# EAGLE design cartridge_adapter (EAGLE 7.5.0)
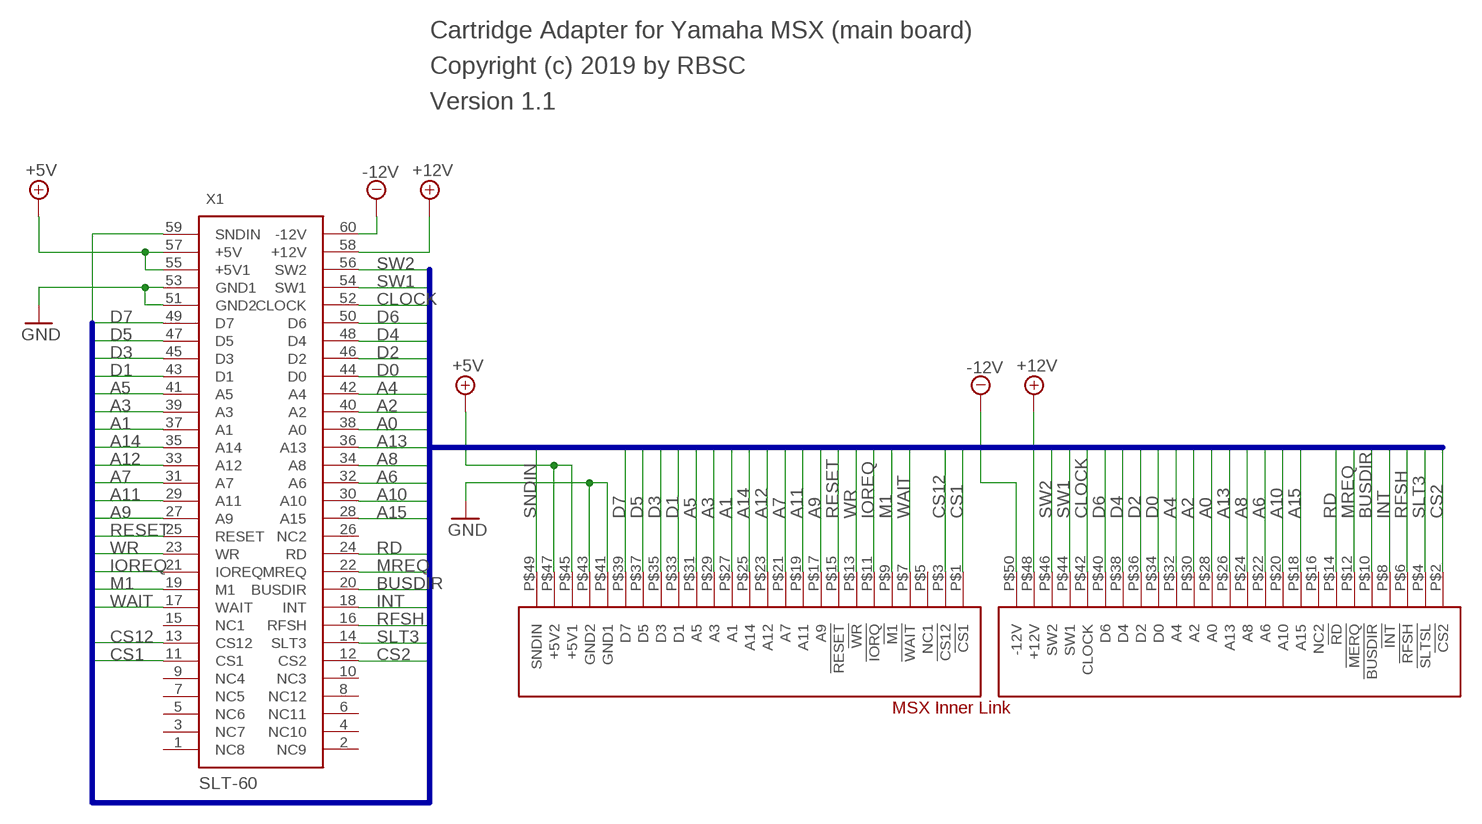
[diagram p0: schematic, sheet 1]

## Parts
CN3  MSX_INNER_LINK  [MSX_INNER_LINK]
X1  SLT-60  [SLT-60]

## Nets
+5V: CN3.P$45(+5V1) CN3.P$47(+5V2) X1.55(+5V1) X1.57(+5V)
+12V: CN3.P$48(+12V) X1.58(+12V)
-12V: CN3.P$50(-12V) X1.60(-12V)
A0: CN3.P$28(A0) X1.38(A0)
A1: CN3.P$27(A1) X1.37(A1)
A2: CN3.P$30(A2) X1.40(A2)
A3: CN3.P$29(A3) X1.39(A3)
A4: CN3.P$32(A4) X1.42(A4)
A5: CN3.P$31(A5) X1.41(A5)
A6: CN3.P$22(A6) X1.32(A6)
A7: CN3.P$21(A7) X1.31(A7)
A8: CN3.P$24(A8) X1.34(A8)
A9: CN3.P$17(A9) X1.27(A9)
A10: CN3.P$20(A10) X1.30(A10)
A11: CN3.P$19(A11) X1.29(A11)
A12: CN3.P$23(A12) X1.33(A12)
A13: CN3.P$26(A13) X1.36(A13)
A14: CN3.P$25(A14) X1.35(A14)
A15: CN3.P$18(A15) X1.28(A15)
BUSDIR: CN3.P$10(!BUSDIR) X1.20(BUSDIR)
CLOCK: CN3.P$42(CLOCK) X1.52(CLOCK)
CS1: CN3.P$1(!CS1) X1.11(CS1)
CS2: CN3.P$2(!CS2) X1.12(CS2)
CS12: CN3.P$3(!CS12) X1.13(CS12)
D0: CN3.P$34(D0) X1.44(D0)
D1: CN3.P$33(D1) X1.43(D1)
D2: CN3.P$36(D2) X1.46(D2)
D3: CN3.P$35(D3) X1.45(D3)
D4: CN3.P$38(D4) X1.48(D4)
D5: CN3.P$37(D5) X1.47(D5)
D6: CN3.P$40(D6) X1.50(D6)
D7: CN3.P$39(D7) X1.49(D7)
GND: CN3.P$41(GND1) CN3.P$43(GND2) X1.51(GND2) X1.53(GND1)
INT: CN3.P$8(!INT) X1.18(INT)
IOREQ: CN3.P$11(!IORQ) X1.21(IOREQ)
M1: CN3.P$9(!M1) X1.19(M1)
MREQ: CN3.P$12(!MERQ) X1.22(MREQ)
RD: CN3.P$14(!RD) X1.24(RD)
RESET: CN3.P$15(!RESET) X1.25(RESET)
RFSH: CN3.P$6(!RFSH) X1.16(RFSH)
SLT3: CN3.P$4(!SLTSL) X1.14(SLT3)
SNDIN: CN3.P$49(SNDIN) X1.59(SNDIN)
SW1: CN3.P$44(SW1) X1.54(SW1)
SW2: CN3.P$46(SW2) X1.56(SW2)
WAIT: CN3.P$7(!WAIT) X1.17(WAIT)
WR: CN3.P$13(!WR) X1.23(WR)
Unconnected: CN3.P$5(NC1) CN3.P$16(NC2) X1.1(NC8) X1.2(NC9) X1.3(NC7) X1.4(NC10) X1.5(NC6) X1.6(NC11) X1.7(NC5) X1.8(NC12) X1.9(NC4) X1.10(NC3) X1.15(NC1) X1.26(NC2)

## Buses
D0,D1,D2,D3,D4,D5,D6,D7,A0,A1,A2,A3,A4,A5,A6,A7,A8,A9,A10,A11,A12,A13,A14,A15,CS1,CS2,CS12,SLT3,RFSH,WAIT,INT,M1,BUSDIR,IOREQ,MREQ,WR,RD,RESET,GND,CLOCK,SW1,SW2,SNDIN

## Notes on the sheet
- Cartridge Adapter for Yamaha MSX (main board)
- Copyright (c) 2019 by RBSC
- Version 1.1

## Library data of the parts
CN3 = msx_inner_link:MSX_INNER_LINK
X1 = slt-60:SLT-60: 60-pin connector side slot

## Board
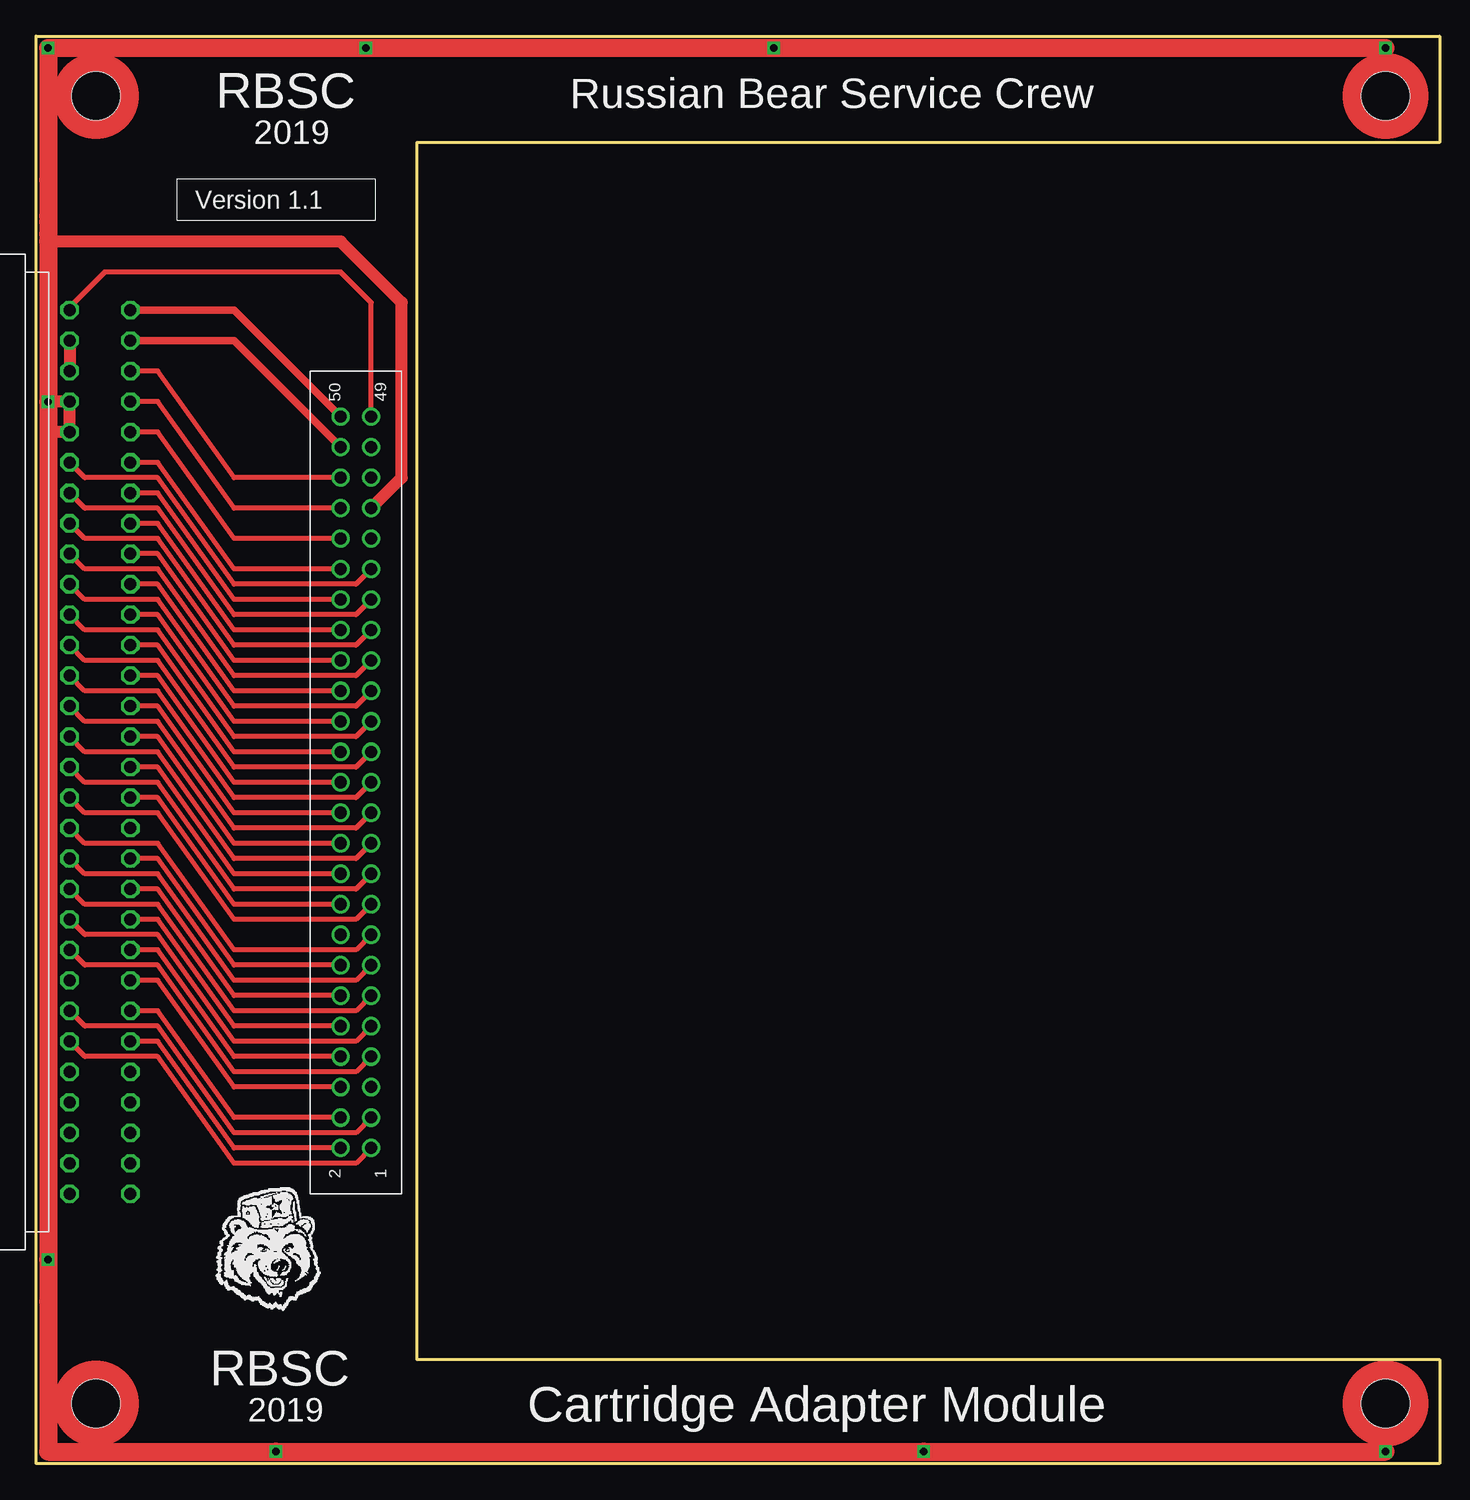
[diagram p1: board, top side]
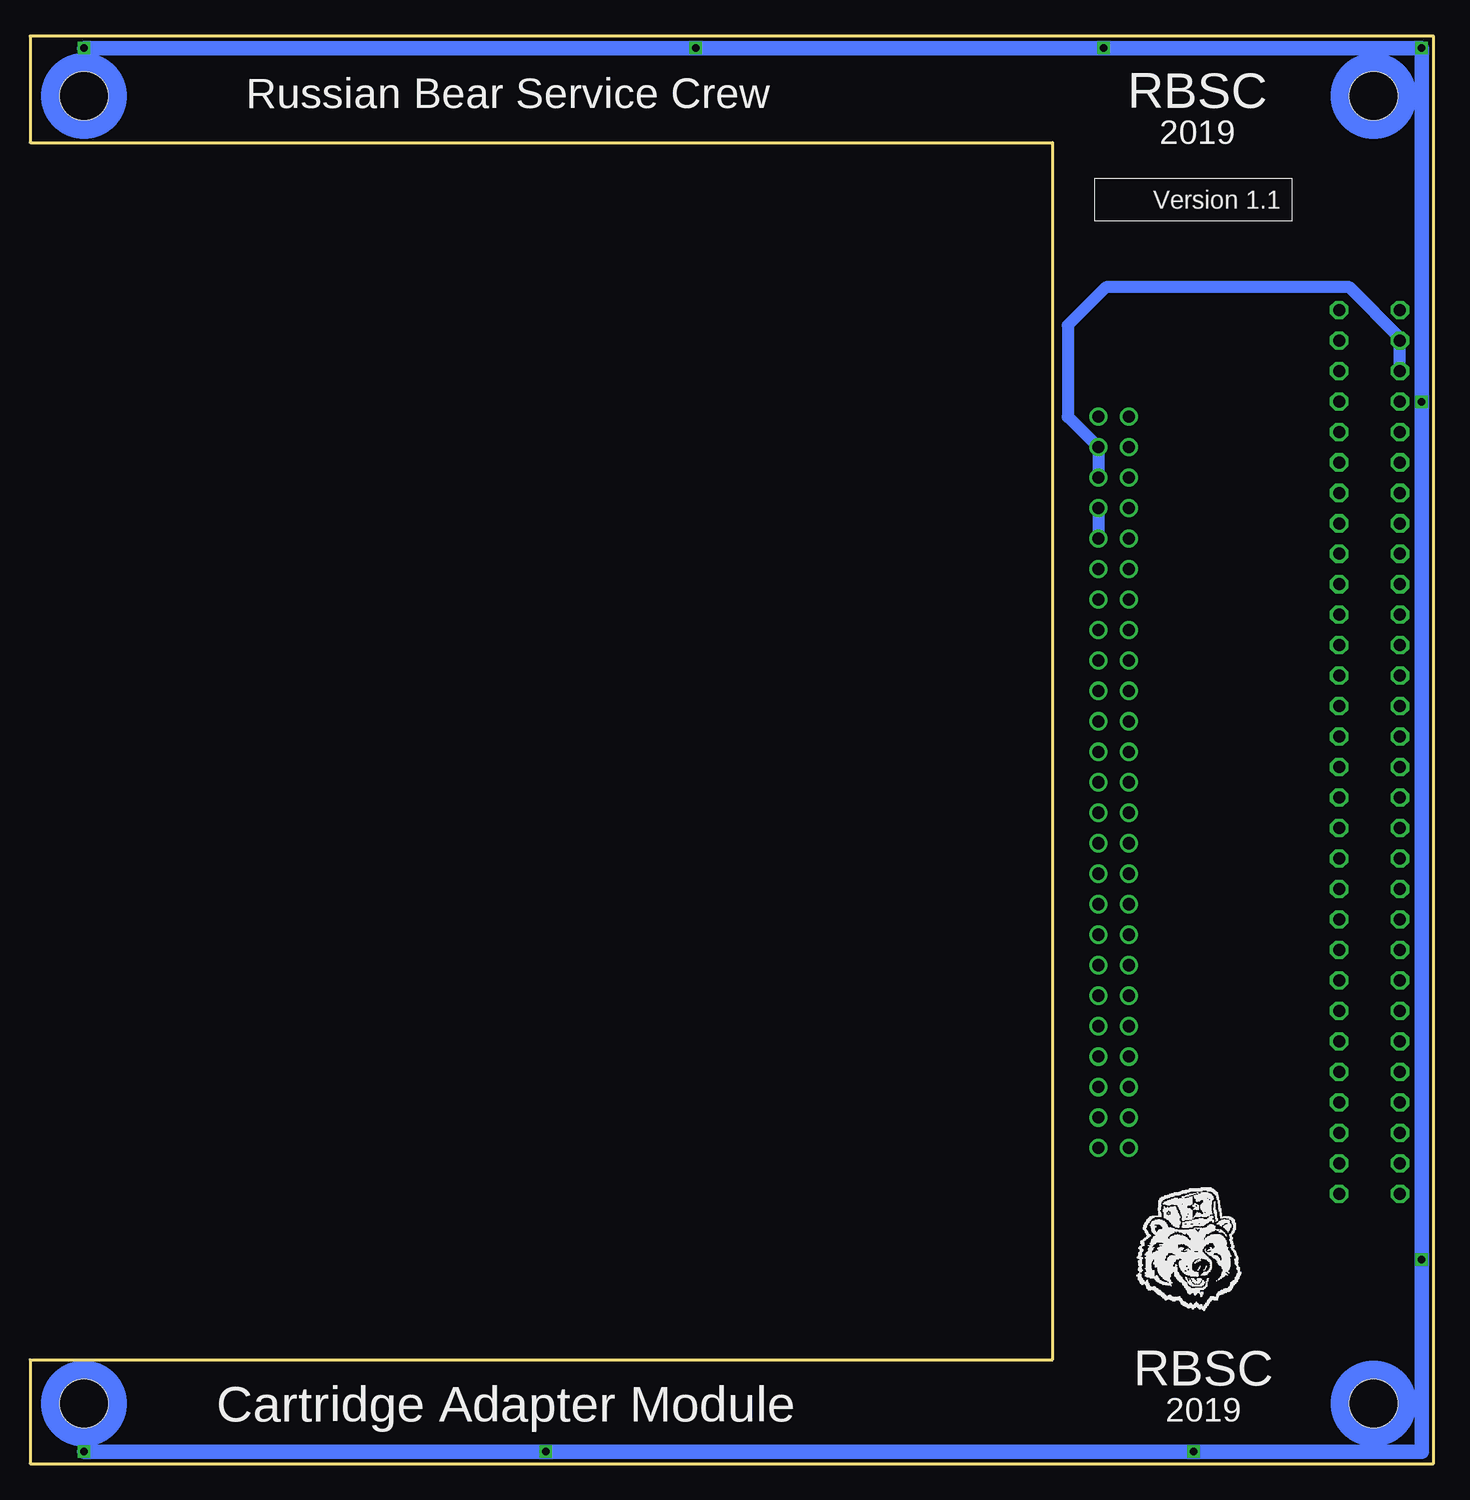
[diagram p2: board, bottom side, seen from below]

Size 117 x 119 mm. Coordinates in mm from the lower left corner, seen from the top.
Outline: 31.75,25.67 31.75,45.35
Outline: 31.75,49.16 31.75,68.22
Outline: 31.75,72.03 31.75,99.97
Outline: 0,0 0,119 117,119 117,110.12 31.75,110.12 31.75,8.65 117,8.65 117,0 0,0
Copper layers (1*16): Top 0.035mm / dielectric 1.5mm / Bottom 0.035mm
Design rules "default *": minimum track width 10mil, minimum drill 24mil, track to track 7mil, track to pad 8mil, pad to pad 8mil, via to via 8mil, smd to smd 8mil, copper to edge 4mil, drill to drill 8mil, minimum pad ring 10mil, minimum via ring 8mil, stop-mask expansion 4mil, vias tented up to drill 24mil, thermal gap 10mil
Holes 4 mm at 5,114 5,5 112.5,114 112.5,5

### Footprints (pad centres in the part's own frame; a part is rotated, then mirrored left to right if it is on the bottom)
MSX_INNER_LINK = drill 1.016: P$1 63.5,5.08; P$2 63.5,2.54; P$3 60.96,5.08; P$4 60.96,2.54; P$5 58.42,5.08; P$6 58.42,2.54; P$7 55.88,5.08; P$8 55.88,2.54; P$9 53.34,5.08; P$10 53.34,2.54; P$11 50.8,5.08; P$12 50.8,2.54; P$13 48.26,5.08; P$14 48.26,2.54; P$15 45.72,5.08; P$16 45.72,2.54; P$17 43.18,5.08; P$18 43.18,2.54; P$19 40.64,5.08; P$20 40.64,2.54; P$21 38.1,5.08; P$22 38.1,2.54; P$23 35.56,5.08; P$24 35.56,2.54; P$25 33.02,5.08; P$26 33.02,2.54; P$27 30.48,5.08; P$28 30.48,2.54; P$29 27.94,5.08; P$30 27.94,2.54; P$31 25.4,5.08; P$32 25.4,2.54; P$33 22.86,5.08; P$34 22.86,2.54; P$35 20.32,5.08; P$36 20.32,2.54; P$37 17.78,5.08; P$38 17.78,2.54; P$39 15.24,5.08; P$40 15.24,2.54; P$41 12.7,5.08; P$42 12.7,2.54; P$43 10.16,5.08; P$44 10.16,2.54; P$45 7.62,5.08; P$46 7.62,2.54; P$47 5.08,5.08; P$48 5.08,2.54; P$49 2.54,5.08; P$50 2.54,2.54
SLT-60 = drill 1 octagon: 1 -36.83,3.81; 2 -36.83,-1.27; 3 -34.29,3.81; 4 -34.29,-1.27; 5 -31.75,3.81; 6 -31.75,-1.27; 7 -29.21,3.81; 8 -29.21,-1.27; 9 -26.67,3.81; 10 -26.67,-1.27; 11 -24.13,3.81; 12 -24.13,-1.27; 13 -21.59,3.81; 14 -21.59,-1.27; 15 -19.05,3.81; 16 -19.05,-1.27; 17 -16.51,3.81; 18 -16.51,-1.27; 19 -13.97,3.81; 20 -13.97,-1.27; 21 -11.43,3.81; 22 -11.43,-1.27; 23 -8.89,3.81; 24 -8.89,-1.27; 25 -6.35,3.81; 26 -6.35,-1.27; 27 -3.81,3.81; 28 -3.81,-1.27; 29 -1.27,3.81; 30 -1.27,-1.27; 31 1.27,3.81; 32 1.27,-1.27; 33 3.81,3.81; 34 3.81,-1.27; 35 6.35,3.81; 36 6.35,-1.27; 37 8.89,3.81; 38 8.89,-1.27; 39 11.43,3.81; 40 11.43,-1.27; 41 13.97,3.81; 42 13.97,-1.27; 43 16.51,3.81; 44 16.51,-1.27; 45 19.05,3.81; 46 19.05,-1.27; 47 21.59,3.81; 48 21.59,-1.27; 49 24.13,3.81; 50 24.13,-1.27; 51 26.67,3.81; 52 26.67,-1.27; 53 29.21,3.81; 54 29.21,-1.27; 55 31.75,3.81; 56 31.75,-1.27; 57 34.29,3.81; 58 34.29,-1.27; 59 36.83,3.81; 60 36.83,-1.27

### Placement (x,y rotation side)
CN3  22.86,89.81 270 top
X1  6.6,59.33 90 top

### Tracks (layer width: path | path; a pad name or v marks a point on that pad's centre or on a via)
+5V
  Top 1: X1.57 X1.55
  Bottom 1.016: X1.55 X1.57 2.79,93.87 6.99,98.06 27.3,98.06 30.48,94.89 30.48,87.27 CN3.P$47 CN3.P$45
+12V
  Top 0.635: X1.58 16.51,93.61 CN3.P$48
-12V
  Top 0.635: CN3.P$50 16.51,96.16 X1.60
A0
  Top 0.4: CN3.P$28 16.51,59.33 10.16,68.22 X1.38
A1
  Top 0.4: CN3.P$27 26.67,58.05 16.51,58.05 10.16,66.94 4.06,66.94 X1.37
A2
  Top 0.4: CN3.P$30 16.51,61.87 10.16,70.75 X1.40
A3
  Top 0.4: CN3.P$29 26.67,60.59 16.51,60.59 10.16,69.48 4.06,69.48 X1.39
A4
  Top 0.4: CN3.P$32 16.51,64.41 10.16,73.3 X1.42
A5
  Top 0.4: X1.41 4.06,72.03 10.16,72.03 16.51,63.14 26.67,63.14 CN3.P$31
A6
  Top 0.4: CN3.P$22 16.51,51.7 10.16,60.59 X1.32
A7
  Top 0.4: CN3.P$21 26.67,50.44 16.51,50.44 10.16,59.33 4.06,59.33 X1.31
A8
  Top 0.4: CN3.P$24 16.51,54.24 10.16,63.14 X1.34
A9
  Top 0.4: CN3.P$17 26.67,45.35 16.51,45.35 10.16,54.24 4.06,54.24 X1.27
A10
  Top 0.4: CN3.P$20 16.51,49.16 10.16,58.05 X1.30
A11
  Top 0.4: CN3.P$19 26.67,47.9 16.51,47.9 10.16,56.78 4.06,56.78 X1.29
A12
  Top 0.4: CN3.P$23 26.67,52.98 16.51,52.98 10.16,61.87 4.06,61.87 X1.33
A13
  Top 0.4: CN3.P$26 16.51,56.78 10.16,65.67 X1.36
A14
  Top 0.4: CN3.P$25 26.67,55.52 16.51,55.52 10.16,64.41 4.06,64.41 X1.35
A15
  Top 0.4: CN3.P$18 16.51,46.62 10.16,55.52 X1.28
BUSDIR
  Top 0.4: CN3.P$10 16.51,36.47 10.16,45.35 X1.20
CLOCK
  Top 0.4: CN3.P$42 16.51,77.11 10.16,86 X1.52
CS1
  Top 0.4: CN3.P$1 26.67,25.04 16.51,25.04 10.16,33.92 4.06,33.92 X1.11
CS2
  Top 0.4: CN3.P$2 16.51,26.3 10.16,35.2 X1.12
CS12
  Top 0.4: CN3.P$3 26.67,27.57 16.51,27.57 10.16,36.47 4.06,36.47 X1.13
D0
  Top 0.4: CN3.P$34 16.51,66.94 10.16,75.83 X1.44
D1
  Top 0.4: CN3.P$33 26.67,65.67 16.51,65.67 10.16,74.56 4.06,74.56 X1.43
D2
  Top 0.4: CN3.P$36 16.51,69.48 10.16,78.38 X1.46
D3
  Top 0.4: CN3.P$35 26.67,68.22 16.51,68.22 10.16,77.11 4.06,77.11 X1.45
D4
  Top 0.4: CN3.P$38 16.51,72.03 10.16,80.92 X1.48
D5
  Top 0.4: CN3.P$37 26.67,70.75 16.51,70.75 10.16,79.64 4.06,79.64 X1.47
D6
  Top 0.4: CN3.P$40 16.51,74.56 10.16,83.45 X1.50
D7
  Top 0.4: CN3.P$39 26.67,73.3 16.51,73.3 10.16,82.19 4.06,82.19 X1.49
GND  (via drill 0.6)
  Top 0.5: 40.5,117.9 40.6,118 | 1.44,17.44 v1,17 | 1.13,13.63 1,13.5 | 27.1,118.2 29.3,118
  Top 1: 1.25,88.25 v1,88.5 1.03,88.53 X1.53 X1.51 | 57.87,1.13 61.5,1.1 | 61.5,1.1 67.99,1.05 | 67.99,1.05 v74,1 74.19,1.19 | 1.27,107.27 1,107 | 20.85,117.85 v27.5,118 | 1,103.73 1,104 | 68,1.06 67.99,1.05 | 61,1.1 61.5,1.1 | 1.23,103.73 1,103.5 | 1.23,102.73 1,102.5
  Top 1.016: CN3.P$43 30.48,82.19 30.48,96.79 25.4,101.87 1,101.87 | X1.51 1.27,86
  Top 1.5: v112.5,118 v61.5,118 40.6,118 29.3,118 v27.5,118 v1,118 1,107 1,104 1,103.5 1,102.5 1,101.87 v1,88.5 v1,17 1,13.5 1,1 v20,1 v74,1 v112.5,1
  Bottom 0.5: 33.45,117.95 33.5,118
  Bottom 1.016: CN3.P$43 CN3.P$41
  Bottom 1.2: v112.5,1 1,1 v1,118 v27.5,118 33.5,118 v112.5,118
INT
  Top 0.4: CN3.P$8 16.51,33.92 10.16,42.81 X1.18
IOREQ
  Top 0.4: CN3.P$11 26.67,37.73 16.51,37.73 10.16,46.62 4.06,46.62 X1.21
M1
  Top 0.4: CN3.P$9 26.67,35.2 16.51,35.2 10.16,44.09 4.06,44.09 X1.19
MREQ
  Top 0.4: CN3.P$12 16.51,39.01 10.16,47.9 X1.22
RD
  Top 0.4: CN3.P$14 16.51,41.55 10.16,50.44 X1.24
RESET
  Top 0.4: CN3.P$15 26.67,42.81 16.51,42.81 10.16,51.7 4.06,51.7 X1.25
RFSH
  Top 0.4: CN3.P$6 16.51,31.38 10.16,40.27 X1.16
SLT3
  Top 0.4: CN3.P$4 16.51,28.84 10.16,37.73 X1.14
SNDIN
  Top 0.4: CN3.P$49 27.94,96.79 25.4,99.33 5.71,99.33 2.79,96.41 X1.59
SW1
  Top 0.4: CN3.P$44 16.51,79.64 10.16,88.53 X1.54
SW2
  Top 0.4: CN3.P$46 16.51,82.19 10.16,91.08 X1.56
WAIT
  Top 0.4: CN3.P$7 26.67,32.66 16.51,32.66 10.16,41.55 4.06,41.55 X1.17
WR
  Top 0.4: CN3.P$13 26.67,40.27 16.51,40.27 10.16,49.16 4.06,49.16 X1.23
(copper drawn outside any net)
  shapes: Bottom circle x4, Top circle x4

### Text on the board
tNames: RBSC | Russian Bear Service Crew | 2019 | Version 1.1 | RBSC | 2019 | Cartridge Adapter Module
bNames: RBSC | Russian Bear Service Crew | 2019 | Version 1.1 | RBSC | 2019 | Cartridge Adapter Module